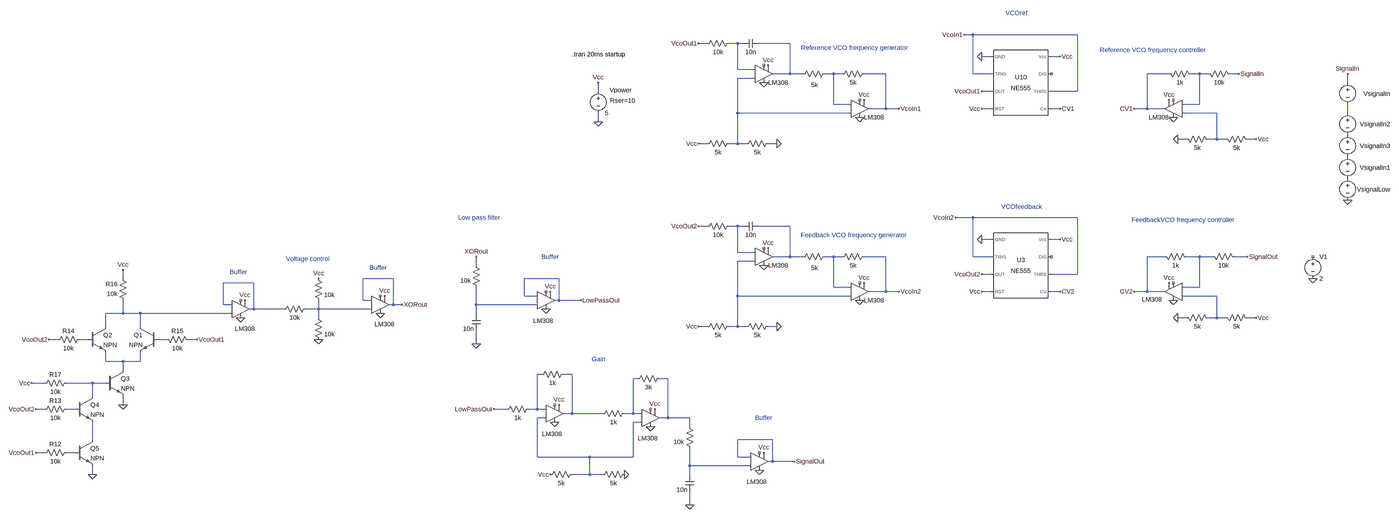
[diagram p0: schematic PLL.asc, whole sheet]
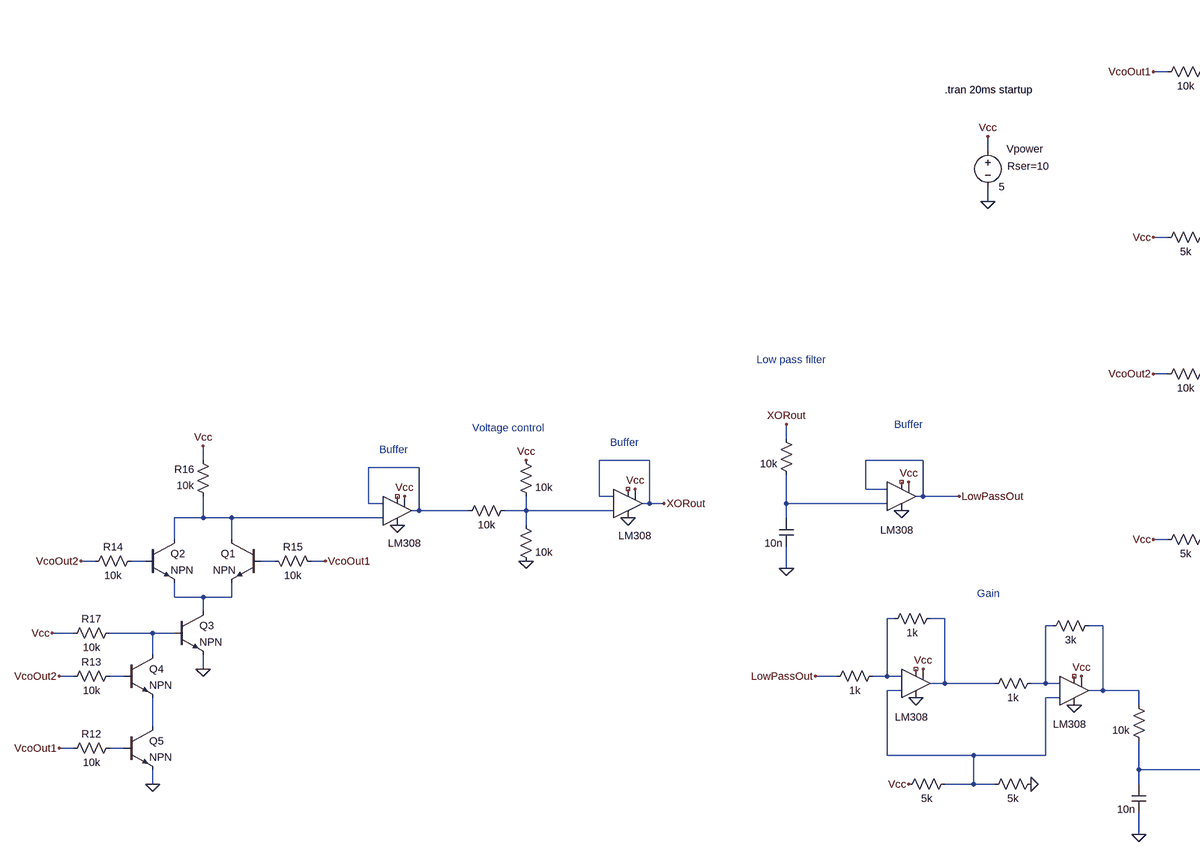
[diagram p1: schematic PLL.asc, part, row 1 of 1, column 1 of 2]
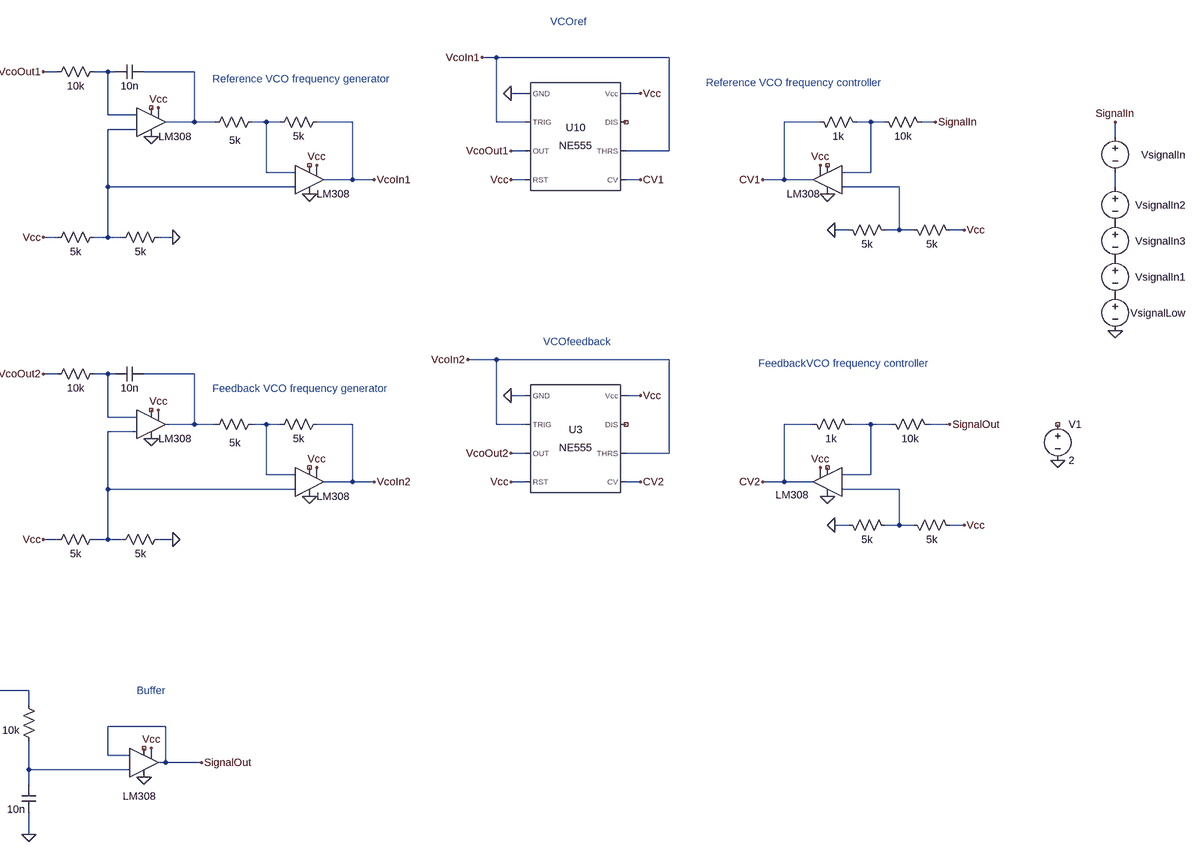
[diagram p2: schematic PLL.asc, part, row 1 of 1, column 2 of 2]
PLL.asc, the LTspice schematic file:
Version 4
SHEET 1 1952 1484
WIRE 224 -368 192 -368
WIRE 608 -368 224 -368
WIRE -752 -336 -784 -336
WIRE -640 -336 -672 -336
WIRE -624 -336 -640 -336
WIRE -448 -336 -560 -336
WIRE 288 -288 256 -288
WIRE 544 -288 512 -288
WIRE -640 -240 -640 -336
WIRE -576 -240 -640 -240
WIRE -448 -224 -448 -336
WIRE -448 -224 -512 -224
WIRE -400 -224 -448 -224
WIRE -288 -224 -320 -224
WIRE -256 -224 -288 -224
WIRE -96 -224 -176 -224
WIRE 224 -224 224 -368
WIRE 288 -224 224 -224
WIRE 944 -224 864 -224
WIRE 1056 -224 1024 -224
WIRE 1088 -224 1056 -224
WIRE 1200 -224 1168 -224
WIRE -576 -208 -640 -208
WIRE 1600 -192 1600 -224
WIRE -1152 -160 -1152 -192
WIRE 288 -160 256 -160
WIRE 608 -160 608 -368
WIRE 608 -160 512 -160
WIRE -288 -112 -288 -224
WIRE -224 -112 -288 -112
WIRE 1056 -112 1056 -224
WIRE 1056 -112 992 -112
WIRE -96 -96 -96 -224
WIRE -96 -96 -160 -96
WIRE -48 -96 -96 -96
WIRE 288 -96 256 -96
WIRE 544 -96 512 -96
WIRE 864 -96 864 -224
WIRE 864 -96 816 -96
WIRE 928 -96 864 -96
WIRE -640 -80 -640 -208
WIRE -224 -80 -640 -80
WIRE 1120 -80 992 -80
WIRE 1600 -80 1600 -112
WIRE -1152 -48 -1152 -80
WIRE 1008 16 976 16
WIRE 1120 16 1120 -80
WIRE 1120 16 1088 16
WIRE 1152 16 1120 16
WIRE 1264 16 1232 16
WIRE -752 32 -784 32
WIRE -640 32 -640 -80
WIRE -640 32 -672 32
WIRE -608 32 -640 32
WIRE -496 32 -528 32
WIRE 224 304 160 304
WIRE 608 304 224 304
WIRE -752 336 -784 336
WIRE -640 336 -672 336
WIRE -624 336 -640 336
WIRE -448 336 -560 336
WIRE 288 384 256 384
WIRE 544 384 512 384
WIRE -640 432 -640 336
WIRE -576 432 -640 432
WIRE -448 448 -448 336
WIRE -448 448 -512 448
WIRE -400 448 -448 448
WIRE -288 448 -320 448
WIRE -256 448 -288 448
WIRE -96 448 -176 448
WIRE 224 448 224 304
WIRE 288 448 224 448
WIRE 928 448 864 448
WIRE 1056 448 1008 448
WIRE 1104 448 1056 448
WIRE 1232 448 1184 448
WIRE -576 464 -640 464
WIRE -1600 480 -1600 448
WIRE 288 512 256 512
WIRE 608 512 608 304
WIRE 608 512 512 512
WIRE -3024 528 -3024 496
WIRE -1936 528 -2048 528
WIRE -1296 528 -1424 528
WIRE -2544 544 -2656 544
WIRE -288 560 -288 448
WIRE -224 560 -288 560
WIRE 1056 560 1056 448
WIRE 1056 560 992 560
WIRE -96 576 -96 448
WIRE -96 576 -160 576
WIRE -48 576 -96 576
WIRE 288 576 256 576
WIRE 544 576 512 576
WIRE 864 576 864 448
WIRE 864 576 816 576
WIRE 928 576 864 576
WIRE -1424 592 -1424 528
WIRE -1376 592 -1424 592
WIRE -640 592 -640 464
WIRE -224 592 -640 592
WIRE 1120 592 992 592
WIRE -2048 608 -2048 528
WIRE -2016 608 -2048 608
WIRE -1296 608 -1296 528
WIRE -1296 608 -1312 608
WIRE -1216 608 -1296 608
WIRE -2656 624 -2656 544
WIRE -2624 624 -2656 624
WIRE -1936 624 -1936 528
WIRE -1936 624 -1952 624
WIRE -1904 624 -1936 624
WIRE -1600 624 -1600 560
WIRE -1376 624 -1600 624
WIRE -2544 640 -2544 544
WIRE -2544 640 -2560 640
WIRE -2352 640 -2544 640
WIRE -2224 640 -2224 608
WIRE -2224 640 -2272 640
WIRE -2016 640 -2224 640
WIRE -3024 656 -3024 608
WIRE -3024 656 -3088 656
WIRE -2960 656 -3024 656
WIRE -2624 656 -2960 656
WIRE -1600 656 -1600 624
WIRE -2224 672 -2224 640
WIRE 1008 672 976 672
WIRE 1120 672 1120 592
WIRE 1120 672 1088 672
WIRE 1152 672 1120 672
WIRE 1264 672 1232 672
WIRE -3088 704 -3088 656
WIRE -2960 704 -2960 656
WIRE -752 704 -784 704
WIRE -640 704 -640 592
WIRE -640 704 -672 704
WIRE -608 704 -640 704
WIRE -496 704 -528 704
WIRE -3264 752 -3296 752
WIRE -3152 752 -3184 752
WIRE -2864 752 -2896 752
WIRE -2752 752 -2784 752
WIRE -1600 768 -1600 720
WIRE -3088 832 -3088 800
WIRE -3024 832 -3088 832
WIRE -2960 832 -2960 800
WIRE -2960 832 -3024 832
WIRE -3024 864 -3024 832
WIRE -1360 880 -1376 880
WIRE -1248 880 -1280 880
WIRE -1008 896 -1024 896
WIRE -896 896 -928 896
WIRE -3312 912 -3360 912
WIRE -3136 912 -3232 912
WIRE -3088 912 -3136 912
WIRE -3136 960 -3136 912
WIRE -3024 992 -3024 960
WIRE -3312 1008 -3344 1008
WIRE -3200 1008 -3232 1008
WIRE -1488 1008 -1536 1008
WIRE -1376 1008 -1376 880
WIRE -1376 1008 -1408 1008
WIRE -1344 1008 -1376 1008
WIRE -1248 1024 -1248 880
WIRE -1248 1024 -1280 1024
WIRE -1136 1024 -1248 1024
WIRE -1024 1024 -1024 896
WIRE -1024 1024 -1056 1024
WIRE -992 1024 -1024 1024
WIRE -1344 1040 -1376 1040
WIRE -896 1040 -896 896
WIRE -896 1040 -928 1040
WIRE -816 1040 -896 1040
WIRE -992 1056 -1024 1056
WIRE -816 1072 -816 1040
WIRE -3136 1120 -3136 1056
WIRE -512 1120 -640 1120
WIRE -3312 1168 -3344 1168
WIRE -3200 1168 -3232 1168
WIRE -1376 1184 -1376 1040
WIRE -1184 1184 -1376 1184
WIRE -1024 1184 -1024 1056
WIRE -1024 1184 -1184 1184
WIRE -640 1184 -640 1120
WIRE -592 1184 -640 1184
WIRE -512 1200 -512 1120
WIRE -512 1200 -528 1200
WIRE -432 1200 -512 1200
WIRE -816 1216 -816 1152
WIRE -592 1216 -816 1216
WIRE -3136 1248 -3136 1216
WIRE -1184 1248 -1184 1184
WIRE -1184 1248 -1248 1248
WIRE -1136 1248 -1184 1248
WIRE -816 1248 -816 1216
WIRE -816 1360 -816 1312
FLAG 544 384 Vcc
FLAG 256 384 0
FLAG 256 576 Vcc
FLAG 256 512 VcoOut2
FLAG 544 576 CV2
FLAG -1600 768 0
FLAG 944 544 Vcc
FLAG 960 608 0
FLAG 976 672 0
FLAG 1264 672 Vcc
FLAG 816 576 CV2
FLAG -1600 448 XORout
FLAG -1328 576 Vcc
FLAG -1344 640 0
FLAG -1904 624 XORout
FLAG -1152 -192 Vcc
FLAG -1152 -48 0
FLAG -784 32 Vcc
FLAG -528 -256 Vcc
FLAG -176 -128 Vcc
FLAG -192 -64 0
FLAG -544 -192 0
FLAG -496 32 0
FLAG 544 -288 Vcc
FLAG 256 -288 0
FLAG 256 -96 Vcc
FLAG 256 -160 VcoOut1
FLAG -784 -336 VcoOut1
FLAG 944 -128 Vcc
FLAG 960 -64 0
FLAG 976 16 0
FLAG 1264 16 Vcc
FLAG 1600 240 0
FLAG 816 -96 CV1
FLAG 544 -96 CV1
FLAG -48 -96 VcoIn1
FLAG 192 -368 VcoIn1
FLAG -784 704 Vcc
FLAG -528 416 Vcc
FLAG -176 544 Vcc
FLAG -192 608 0
FLAG -544 480 0
FLAG -496 704 0
FLAG -784 336 VcoOut2
FLAG -48 576 VcoIn2
FLAG 160 304 VcoIn2
FLAG -1984 656 0
FLAG -1968 592 Vcc
FLAG -2224 528 Vcc
FLAG -2224 752 0
FLAG 1200 -224 SignalIn
FLAG 1600 -224 SignalIn
FLAG 1232 448 SignalOut
FLAG -1216 608 LowPassOut
FLAG -1296 992 Vcc
FLAG -1312 1056 0
FLAG -1056 1248 0
FLAG -1328 1248 Vcc
FLAG -1536 1008 LowPassOut
FLAG -944 1008 Vcc
FLAG -960 1072 0
FLAG -432 1200 SignalOut
FLAG 1472 528 0
FLAG -816 1360 0
FLAG -544 1168 Vcc
FLAG -560 1232 0
FLAG -3024 992 0
FLAG -3136 1248 0
FLAG -3344 1008 VcoOut2
FLAG -3344 1168 VcoOut1
FLAG -3296 752 VcoOut2
FLAG -2752 752 VcoOut1
FLAG -3024 496 Vcc
FLAG -3360 912 Vcc
FLAG -2592 672 0
FLAG -2576 608 Vcc
SYMBOL Misc\\NE555 400 480 R0
SYMATTR InstName U3
SYMBOL res -1584 576 R180
WINDOW 0 36 76 Invisible 2
WINDOW 3 36 40 Left 2
SYMATTR InstName R7
SYMATTR Value 10k
SYMBOL cap -1584 720 R180
WINDOW 0 24 56 Invisible 2
WINDOW 3 24 8 Left 2
SYMATTR InstName C3
SYMATTR Value 10n
SYMBOL OpAmps\\LM308 960 512 M0
WINDOW 3 41 93 Left 2
WINDOW 0 32 32 Invisible 2
SYMATTR InstName U5
SYMBOL res 912 432 M90
WINDOW 0 0 56 Invisible 2
WINDOW 3 32 56 VTop 2
SYMATTR InstName R8
SYMATTR Value 1k
SYMBOL res 1088 432 M90
WINDOW 0 0 56 Invisible 2
WINDOW 3 32 56 VTop 2
SYMATTR InstName R9
SYMATTR Value 10k
SYMBOL res 1136 656 M90
WINDOW 0 0 56 Invisible 2
WINDOW 3 32 56 VTop 2
SYMATTR InstName R10
SYMATTR Value 5k
SYMBOL res 992 656 M90
WINDOW 0 0 56 Invisible 2
WINDOW 3 32 56 VTop 2
SYMATTR InstName R11
SYMATTR Value 5k
SYMBOL OpAmps\\LM308 -1344 544 R0
WINDOW 0 -38 7 Invisible 2
WINDOW 3 -47 139 Left 2
SYMATTR InstName U6
SYMBOL voltage -1152 -176 R0
WINDOW 123 0 0 Left 0
WINDOW 39 43 50 Left 2
WINDOW 0 42 12 Left 2
SYMATTR SpiceLine Rser=10
SYMATTR InstName Vpower
SYMATTR Value 5
SYMBOL OpAmps\\LM308 -544 -288 R0
WINDOW 0 32 32 Invisible 2
SYMATTR InstName U8
SYMBOL OpAmps\\LM308 -192 -160 R0
WINDOW 0 32 32 Invisible 2
SYMATTR InstName U9
SYMBOL res -656 16 R90
WINDOW 0 0 56 Invisible 2
WINDOW 3 32 56 VTop 2
SYMATTR InstName R20
SYMATTR Value 5k
SYMBOL res -512 16 R90
WINDOW 0 0 56 Invisible 2
WINDOW 3 32 56 VTop 2
SYMATTR InstName R21
SYMATTR Value 5k
SYMBOL res -304 -240 R90
WINDOW 0 0 56 Invisible 2
WINDOW 3 41 54 VTop 2
SYMATTR InstName R22
SYMATTR Value 5k
SYMBOL res -160 -240 R90
WINDOW 0 0 56 Invisible 2
WINDOW 3 32 56 VTop 2
SYMATTR InstName R23
SYMATTR Value 5k
SYMBOL res -656 -352 R90
WINDOW 0 0 56 Invisible 2
WINDOW 3 32 56 VTop 2
SYMATTR InstName R24
SYMATTR Value 10k
SYMBOL cap -560 -352 R90
WINDOW 0 0 32 Invisible 2
WINDOW 3 32 32 VTop 2
SYMATTR InstName C4
SYMATTR Value 10n
SYMBOL Misc\\NE555 400 -192 R0
SYMATTR InstName U10
SYMBOL OpAmps\\LM308 960 -160 M0
WINDOW 0 32 32 Invisible 2
SYMATTR InstName U11
SYMBOL res 928 -240 M90
WINDOW 0 0 56 Invisible 2
WINDOW 3 32 56 VTop 2
SYMATTR InstName R25
SYMATTR Value 1k
SYMBOL res 1072 -240 M90
WINDOW 0 0 56 Invisible 2
WINDOW 3 32 56 VTop 2
SYMATTR InstName R26
SYMATTR Value 10k
SYMBOL voltage 1600 -208 M0
WINDOW 123 0 0 Left 0
WINDOW 39 0 0 Left 0
WINDOW 0 -157 57 Left 2
WINDOW 3 -78 108 Invisible 2
SYMATTR InstName VsignalIn
SYMATTR Value PULSE(0 1 2m 100u 100u 0.9m 2m 5)
SYMBOL res 1136 0 M90
WINDOW 0 0 56 Invisible 2
WINDOW 3 32 56 VTop 2
SYMATTR InstName R27
SYMATTR Value 5k
SYMBOL res 992 0 M90
WINDOW 0 0 56 Invisible 2
WINDOW 3 32 56 VTop 2
SYMATTR InstName R28
SYMATTR Value 5k
SYMBOL OpAmps\\LM308 -544 384 R0
WINDOW 0 32 32 Invisible 2
SYMATTR InstName U1
SYMBOL OpAmps\\LM308 -192 512 R0
WINDOW 0 32 32 Invisible 2
SYMATTR InstName U2
SYMBOL res -656 688 R90
WINDOW 0 0 56 Invisible 2
WINDOW 3 32 56 VTop 2
SYMATTR InstName R1
SYMATTR Value 5k
SYMBOL res -512 688 R90
WINDOW 0 0 56 Invisible 2
WINDOW 3 32 56 VTop 2
SYMATTR InstName R2
SYMATTR Value 5k
SYMBOL res -304 432 R90
WINDOW 0 0 56 Invisible 2
WINDOW 3 41 54 VTop 2
SYMATTR InstName R3
SYMATTR Value 5k
SYMBOL res -160 432 R90
WINDOW 0 0 56 Invisible 2
WINDOW 3 32 56 VTop 2
SYMATTR InstName R4
SYMATTR Value 5k
SYMBOL res -656 320 R90
WINDOW 0 0 56 Invisible 2
WINDOW 3 32 56 VTop 2
SYMATTR InstName R5
SYMATTR Value 10k
SYMBOL cap -560 320 R90
WINDOW 0 0 32 Invisible 2
WINDOW 3 32 32 VTop 2
SYMATTR InstName C1
SYMATTR Value 10n
SYMBOL res -2240 512 R0
WINDOW 0 36 40 Invisible 2
SYMATTR InstName R32
SYMATTR Value 10k
SYMBOL res -2240 656 R0
WINDOW 0 36 40 Invisible 2
SYMATTR InstName R33
SYMATTR Value 10k
SYMBOL res -2256 624 R90
WINDOW 0 0 56 Invisible 2
WINDOW 3 32 56 VTop 2
SYMATTR InstName R34
SYMATTR Value 10k
SYMBOL OpAmps\\LM308 -1984 560 R0
WINDOW 0 -50 7 Invisible 2
WINDOW 3 -21 136 Left 2
SYMATTR InstName U13
SYMBOL OpAmps\\LM308 -1312 960 R0
WINDOW 0 -38 7 Invisible 2
WINDOW 3 -47 139 Left 2
SYMATTR InstName U12
SYMBOL res -1392 992 R90
WINDOW 0 0 56 Invisible 2
WINDOW 3 32 56 VTop 2
SYMATTR InstName R6
SYMATTR Value 1k
SYMBOL res -1264 864 R90
WINDOW 0 0 56 Invisible 2
WINDOW 3 32 56 VTop 2
SYMATTR InstName R29
SYMATTR Value 1k
SYMBOL res -1040 1232 R90
WINDOW 0 0 56 Invisible 2
WINDOW 3 32 56 VTop 2
SYMATTR InstName R30
SYMATTR Value 5k
SYMBOL res -1232 1232 R90
WINDOW 0 0 56 Invisible 2
WINDOW 3 32 56 VTop 2
SYMATTR InstName R31
SYMATTR Value 5k
SYMBOL OpAmps\\LM308 -960 976 R0
WINDOW 0 -38 7 Invisible 2
WINDOW 3 -47 139 Left 2
SYMATTR InstName U14
SYMBOL res -1040 1008 R90
WINDOW 0 0 56 Invisible 2
WINDOW 3 32 56 VTop 2
SYMATTR InstName R35
SYMATTR Value 1k
SYMBOL res -912 880 R90
WINDOW 0 0 56 Invisible 2
WINDOW 3 32 56 VTop 2
SYMATTR InstName R36
SYMATTR Value 3k
SYMBOL voltage 1472 432 R0
WINDOW 123 0 0 Left 0
WINDOW 39 0 0 Left 0
SYMATTR InstName V1
SYMATTR Value 2
SYMBOL res -800 1168 R180
WINDOW 0 36 76 Invisible 2
WINDOW 3 36 40 Left 2
SYMATTR InstName R37
SYMATTR Value 10k
SYMBOL cap -800 1312 R180
WINDOW 0 24 56 Invisible 2
WINDOW 3 24 8 Left 2
SYMATTR InstName C2
SYMATTR Value 10n
SYMBOL OpAmps\\LM308 -560 1136 R0
WINDOW 0 -38 7 Invisible 2
WINDOW 3 -47 139 Left 2
SYMATTR InstName U15
SYMBOL voltage 1600 64 M0
WINDOW 123 0 0 Left 0
WINDOW 39 0 0 Left 0
WINDOW 0 -157 57 Left 2
WINDOW 3 -78 108 Invisible 2
SYMATTR InstName VsignalIn1
SYMATTR Value PULSE(0 1 17m 100u 100u 0.9m 1m 1)
SYMBOL voltage 1600 144 M0
WINDOW 123 0 0 Left 0
WINDOW 39 0 0 Left 0
WINDOW 0 -157 57 Left 2
WINDOW 3 -78 108 Invisible 2
SYMATTR InstName VsignalLow
SYMATTR Value 2V
SYMBOL voltage 1600 -96 M0
WINDOW 123 0 0 Left 0
WINDOW 39 0 0 Left 0
WINDOW 0 -157 57 Left 2
WINDOW 3 -78 108 Invisible 2
SYMATTR InstName VsignalIn2
SYMATTR Value PULSE(0 1 13m 100u 100u 0.9m 1m 1)
SYMBOL voltage 1600 -16 M0
WINDOW 123 0 0 Left 0
WINDOW 39 0 0 Left 0
WINDOW 0 -157 57 Left 2
WINDOW 3 -78 108 Invisible 2
SYMATTR InstName VsignalIn3
SYMATTR Value PULSE(0 1 14m 100u 100u 0.9m 2m 1)
SYMBOL npn -2896 704 M0
SYMATTR InstName Q1
SYMBOL npn -3152 704 R0
SYMATTR InstName Q2
SYMBOL npn -3088 864 R0
SYMATTR InstName Q3
SYMBOL npn -3200 960 R0
SYMATTR InstName Q4
SYMBOL npn -3200 1120 R0
SYMATTR InstName Q5
SYMBOL res -3216 1152 R90
WINDOW 0 0 56 VBottom 2
WINDOW 3 32 56 VTop 2
SYMATTR InstName R12
SYMATTR Value 10k
SYMBOL res -3216 992 R90
WINDOW 0 0 56 VBottom 2
WINDOW 3 32 56 VTop 2
SYMATTR InstName R13
SYMATTR Value 10k
SYMBOL res -3168 736 R90
WINDOW 0 0 56 VBottom 2
WINDOW 3 32 56 VTop 2
SYMATTR InstName R14
SYMATTR Value 10k
SYMBOL res -2880 736 M90
WINDOW 0 0 56 VBottom 2
WINDOW 3 32 56 VTop 2
SYMATTR InstName R15
SYMATTR Value 10k
SYMBOL res -3008 624 R180
WINDOW 0 36 76 Left 2
WINDOW 3 36 40 Left 2
SYMATTR InstName R16
SYMATTR Value 10k
SYMBOL res -3216 896 R90
WINDOW 0 0 56 VBottom 2
WINDOW 3 32 56 VTop 2
SYMATTR InstName R17
SYMATTR Value 10k
SYMBOL OpAmps\\LM308 -2592 576 R0
WINDOW 0 -50 7 Invisible 2
WINDOW 3 -21 136 Left 2
SYMATTR InstName U4
TEXT -1248 -296 Left 2 !.tran 20ms startup
TEXT 344 -448 Left 2 ;VCOref
TEXT 328 264 Left 2 ;VCOfeedback
TEXT -1512 304 Right 2 ;Low pass filter
TEXT 1080 -312 Right 2 ;Reference VCO frequency controller
TEXT -408 -320 Left 2 ;Reference VCO frequency generator
TEXT -408 368 Left 2 ;Feedback VCO frequency generator
TEXT -1360 448 Left 2 ;Buffer
TEXT -2024 488 Left 2 ;Buffer
TEXT 1184 312 Right 2 ;FeedbackVCO frequency controller
TEXT -2344 456 Left 2 ;Voltage control
TEXT -1176 824 Left 2 ;Gain
TEXT -576 1040 Left 2 ;Buffer
TEXT -2632 504 Left 2 ;Buffer

The netlist it stands for:
* PLL.asc
XU3 0 VcoIn2 VcoOut2 Vcc CV2 VcoIn2 NC_01 Vcc NE555  ; pins GND TRIG OUT RST CV THRS DIS Vcc
R7 N015 XORout 10k
C3 0 N015 10n
XU5 N014 N011 Vcc 0 CV2 NC_02 NC_03 LT1008
R8 CV2 N011 1k
R9 N011 SignalOut 10k
R10 N014 Vcc 5k
R11 0 N014 5k
XU6 N015 LowPassOut Vcc 0 LowPassOut NC_04 NC_05 LT1008
Vpower Vcc 0 5 Rser=10
XU8 N005 N001 Vcc 0 N002 NC_06 NC_07 LT1008
XU9 N005 N003 Vcc 0 VcoIn1 NC_08 NC_09 LT1008
R20 N005 Vcc 5k
R21 0 N005 5k
R22 N003 N002 5k
R23 VcoIn1 N003 5k
R24 N001 VcoOut1 10k
C4 N002 N001 10n
XU10 0 VcoIn1 VcoOut1 Vcc CV1 VcoIn1 NC_10 Vcc NE555  ; pins GND TRIG OUT RST CV THRS DIS Vcc
XU11 N006 N004 Vcc 0 CV1 NC_11 NC_12 LT1008
R25 CV1 N004 1k
R26 N004 SignalIn 10k
VsignalIn SignalIn N007 PULSE(0 1 2m 100u 100u 0.9m 2m 5)
R27 N006 Vcc 5k
R28 0 N006 5k
XU1 N012 N008 Vcc 0 N009 NC_13 NC_14 LT1008
XU2 N012 N010 Vcc 0 VcoIn2 NC_15 NC_16 LT1008
R1 N012 Vcc 5k
R2 0 N012 5k
R3 N010 N009 5k
R4 VcoIn2 N010 5k
R5 N008 VcoOut2 10k
C1 N009 N008 10n
R32 Vcc N016 10k
R33 N016 0 10k
R34 N016 N013 10k
XU13 N016 XORout Vcc 0 XORout NC_17 NC_18 LT1008
XU12 N027 N021 Vcc 0 N022 NC_19 NC_20 LT1008
R6 N021 LowPassOut 1k
R29 N022 N021 1k
R30 0 N027 5k
R31 N027 Vcc 5k
XU14 N027 N023 Vcc 0 N024 NC_21 NC_22 LT1008
R35 N023 N022 1k
R36 N024 N023 3k
V1 NC_23 0 2
R37 N030 N024 10k
C2 0 N030 10n
XU15 N030 SignalOut Vcc 0 SignalOut NC_24 NC_25 LT1008
VsignalIn1 P001 P002 PULSE(0 1 17m 100u 100u 0.9m 1m 1)
VsignalLow P002 0 2V
VsignalIn2 N007 P003 PULSE(0 1 13m 100u 100u 0.9m 1m 1)
VsignalIn3 P003 P001 PULSE(0 1 14m 100u 100u 0.9m 2m 1)
Q1 N017 N019 N020 0 NPN
Q2 N017 N018 N020 0 NPN
Q3 N020 N025 0 0 NPN
Q4 N025 N026 N028 0 NPN
Q5 N028 N029 0 0 NPN
R12 N029 VcoOut1 10k
R13 N026 VcoOut2 10k
R14 N018 VcoOut2 10k
R15 N019 VcoOut1 10k
R16 N017 Vcc 10k
R17 N025 Vcc 10k
XU4 N017 N013 Vcc 0 N013 NC_26 NC_27 LT1008
.model NPN NPN
.model PNP PNP
.lib standard.bjt
.tran 20ms startup
* VCOref
* VCOfeedback
* Low pass filter
* Reference VCO frequency controller
* Reference VCO frequency generator
* Feedback VCO frequency generator
* Buffer
* Buffer
* FeedbackVCO frequency controller
* Voltage control
* Gain
* Buffer
* Buffer
.lib NE555.sub
.lib LTC.lib
.backanno
.end